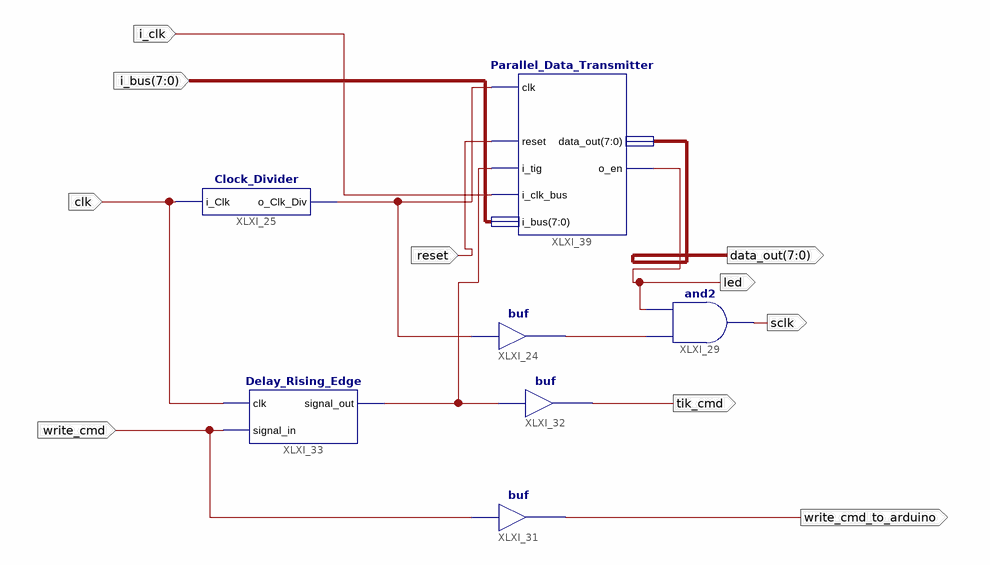
[diagram p0: schematic sheet 1]
// Xilinx ISE schematic top.sch (spartan6) as structural Verilog: 7 symbols, 10 ports
module top (
  input  reset,
  input  clk,
  input  write_cmd,
  input  i_clk,
  input  [7:0] i_bus,
  output [7:0] data_out,
  output led,
  output sclk,
  output write_cmd_to_arduino,
  output tik_cmd
);

  wire asdasd, ikljhfluiysdliy, tig;

  buf XLXI_24 (ikljhfluiysdliy, asdasd);
  Clock_Divider XLXI_25 (.i_Clk(clk), .o_Clk_Div(asdasd));
  and XLXI_29 (sclk, ikljhfluiysdliy, led);
  buf XLXI_31 (write_cmd_to_arduino, write_cmd);
  buf XLXI_32 (tik_cmd, tig);
  Delay_Rising_Edge XLXI_33 (.clk(clk), .signal_in(write_cmd), .signal_out(tig));
  Parallel_Data_Transmitter XLXI_39 (
    .clk(asdasd), .reset(reset), .i_tig(tig), .i_clk_bus(i_clk), .i_bus(i_bus), .o_en(led),
    .data_out(data_out));
endmodule
